# EAGLE schematic main (EAGLE 8.4.2)
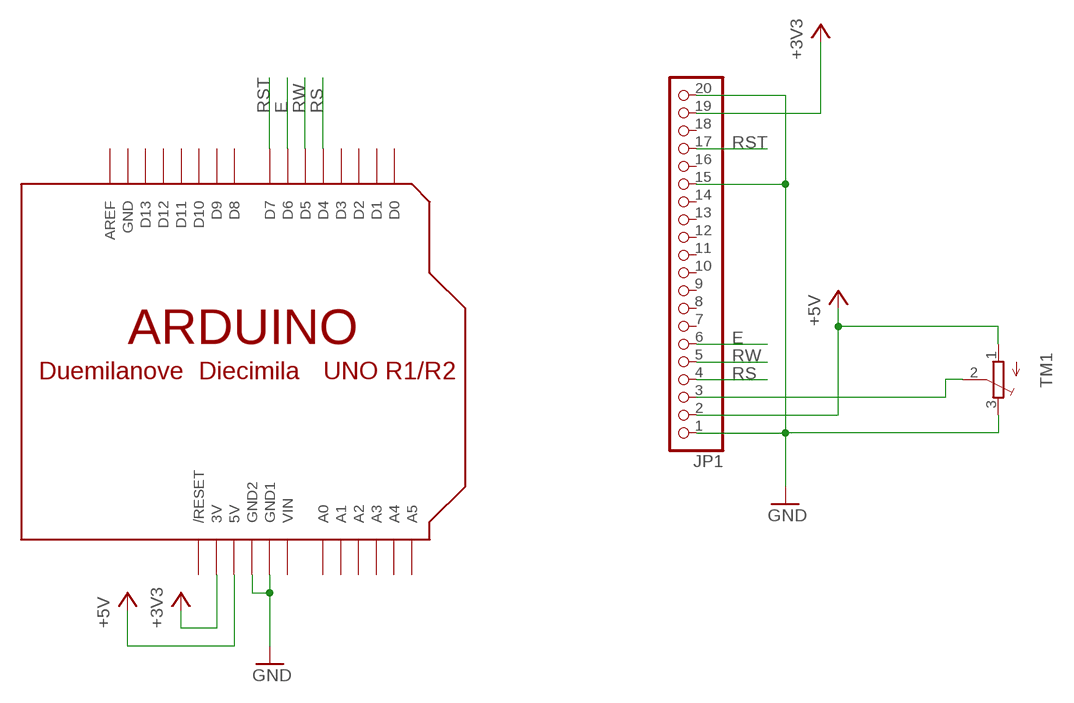
[diagram p0: schematic, sheet 1]

## Parts
JP1  PINHD-1X20  [1X20]
TM1  TRIMPOT3386  [TRIM-3386]
U$1  ARDUINOUNO  [ARDUINO]

## Nets
+3V3: JP1.19 U$1.3V
+5V: JP1.2 TM1.1(A) U$1.5V
E: JP1.6 U$1.D6
GND: JP1.1 JP1.15 JP1.20 TM1.3(E) U$1.GND1 U$1.GND2
N$3: JP1.3 TM1.2(S)
RS: JP1.4 U$1.D4
RST: JP1.17 U$1.D7
RW: JP1.5 U$1.D5
Unconnected: JP1.7 JP1.8 JP1.9 JP1.10 JP1.11 JP1.12 JP1.13 JP1.14 JP1.16 JP1.18 U$1.A0 U$1.A1 U$1.A2 U$1.A3 U$1.A4 U$1.A5 U$1.AREF U$1.D0 U$1.D1 U$1.D2 U$1.D3 U$1.D8 U$1.D9 U$1.D10 U$1.D11 U$1.D12 U$1.D13 U$1.RESET(/RESET)

## Power pins joined to a net without a drawn wire
GND: U$1.GND
VIN: U$1.VIN

## Library data of the parts
JP1 = pinhead:PINHD-1X20: PIN HEADER
TM1 = adafruit:TRIMPOT: SMT trimmer potentiometer part number TC33X http://www.ladyada.net/library/eagle
U$1 = adafruit:ARDUINO: Arduino Diecimila/Duemilanove Make a shield with ease, this package has all the named pins as well as the two mounting drill holes and an outline of the USB and DC power connector. The outline is on the DIMENSION layer, so if your board house uses it they will cut the outline to match. http://www.ladyada.net/library/pcb/eaglelibrary.html